# Altium schematic sheet mounting_holes.SchDoc
size 297 x 209 mm
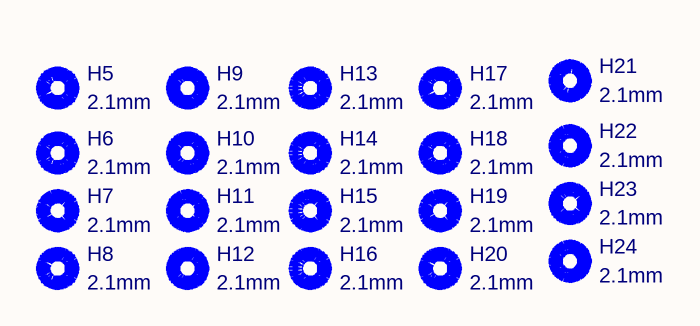
[diagram p0: mounting_holes.SchDoc]

## Parts
H5  2.1mm  [MountingHole_2.2mm_M2_Pad_TopBottom]
H6  2.1mm  [MountingHole_2.2mm_M2_Pad_TopBottom]
H7  2.1mm  [MountingHole_2.2mm_M2_Pad_TopBottom]
H8  2.1mm  [MountingHole_2.2mm_M2_Pad_TopBottom]
H9  2.1mm  [MountingHole_2.2mm_M2_Pad_TopBottom]
H10  2.1mm  [MountingHole_2.2mm_M2_Pad_TopBottom]
H11  2.1mm  [MountingHole_2.2mm_M2_Pad_TopBottom]
H12  2.1mm  [MountingHole_2.2mm_M2_Pad_TopBottom]
H13  2.1mm  [MountingHole_2.2mm_M2_Pad_TopBottom]
H14  2.1mm  [MountingHole_2.2mm_M2_Pad_TopBottom]
H15  2.1mm  [MountingHole_2.2mm_M2_Pad_TopBottom]
H16  2.1mm  [MountingHole_2.2mm_M2_Pad_TopBottom]
H17  2.1mm  [MountingHole_2.2mm_M2_Pad_TopBottom]
H18  2.1mm  [MountingHole_2.2mm_M2_Pad_TopBottom]
H19  2.1mm  [MountingHole_2.2mm_M2_Pad_TopBottom]
H20  2.1mm  [MountingHole_2.2mm_M2_Pad_TopBottom]
H21  2.1mm  [MountingHole_2.2mm_M2_Pad_TopBottom]
H22  2.1mm  [MountingHole_2.2mm_M2_Pad_TopBottom]
H23  2.1mm  [MountingHole_2.2mm_M2_Pad_TopBottom]
H24  2.1mm  [MountingHole_2.2mm_M2_Pad_TopBottom]

## Notes on the sheet
- 1
- 2
- 3
- 4
- 5
- 6
- A
- B
- C
- D
- Title: Antenna Deployment Board
- File: mounting_holes.kicad_sch
- Sheet: /
- Queen's Space Engineering Team - Satellite
- KiCad E.D.A.  kicad (5.1.4)-1
- Size: A4
- Date: 2023-04-24
- Rev: RevA
- Id: 1/1

## Library data of the parts
H5-H24 = MountingHole: Value: 2.1mm; Footprint: MountingHole:MountingHole_2.2mm_M2_Pad_TopBottom